# Altium project PE2.PrjPcb
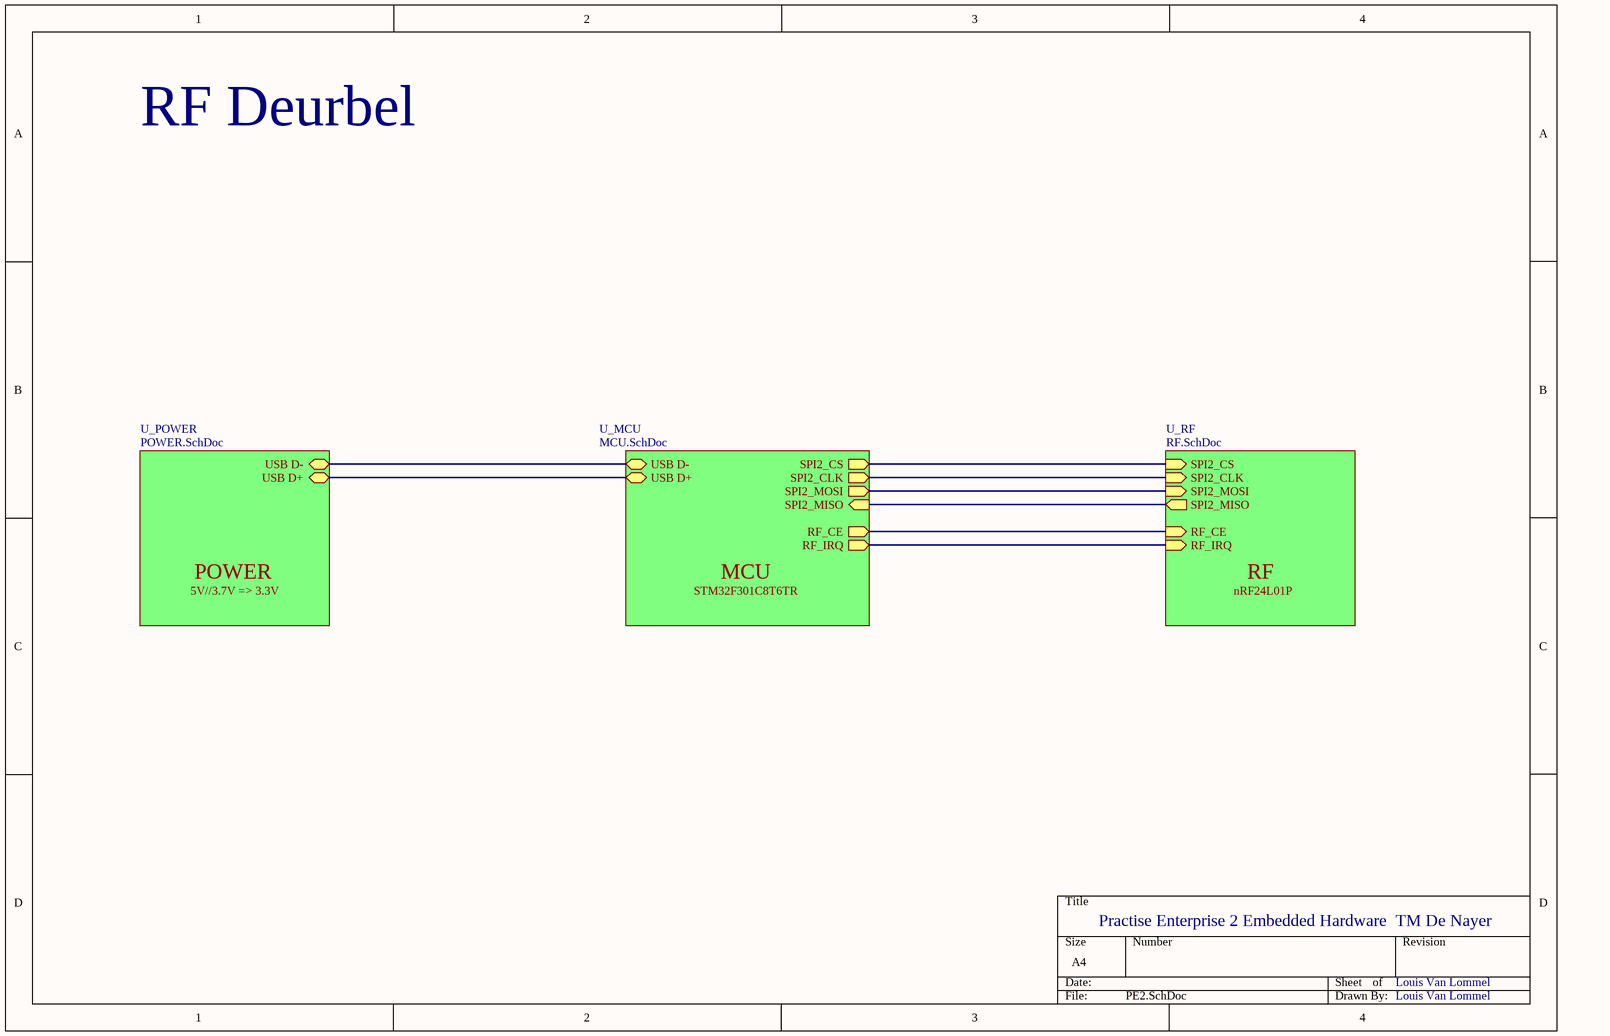
[diagram p0: PE2.SchDoc]
4 sheets, 62 parts. Net scope: hierarchical (ports join the sheet entries above them; power ports are global).
Board file: PE2.PcbDoc
Sheets:
  PE2.SchDoc
    U_POWER = POWER.SchDoc
    U_RF = RF.SchDoc
    U_MCU = MCU.SchDoc

## Sheet PE2.SchDoc
size A4

### Sub-sheets
U_MCU = MCU.SchDoc: USB D+ (bidir), USB D- (bidir), SPI2_CS (out), SPI2_CLK (out), SPI2_MISO (in), SPI2_MOSI (out), RF_CE (out), RF_IRQ (out)
U_POWER = POWER.SchDoc: USB D+ (bidir), USB D- (bidir)
U_RF = RF.SchDoc: SPI2_MOSI (in), SPI2_MISO (out), SPI2_CLK (in), SPI2_CS (in), RF_CE (in), RF_IRQ (in)

### Nets
NetD2_1: sheet U_POWER/USB D+, sheet U_MCU/USB D+
NetD2_3: sheet U_POWER/USB D-, sheet U_MCU/USB D-
NetU1_1: sheet U_RF/RF_CE, sheet U_MCU/RF_CE
NetU1_2: sheet U_RF/SPI2_CS, sheet U_MCU/SPI2_CS
NetU1_3: sheet U_RF/SPI2_CLK, sheet U_MCU/SPI2_CLK
NetU1_4: sheet U_RF/SPI2_MOSI, sheet U_MCU/SPI2_MOSI
NetU1_5: sheet U_RF/SPI2_MISO, sheet U_MCU/SPI2_MISO
NetU1_6: sheet U_RF/RF_IRQ, sheet U_MCU/RF_IRQ

### Notes on the sheet
- RF Deurbel
- POWER
- MCU
- RF
- 5V//3.7V => 3.3V
- STM32F301C8T6TR
- nRF24L01P
- Practise Enterprise 2 Embedded Hardware  TM De Nayer
- Louis Van Lommel

## Sheet POWER.SchDoc: Power
size A4; DrawnBy: Louis Van Lommel; Engineer: Louis Van Lommel; Organization: TM De Nayer
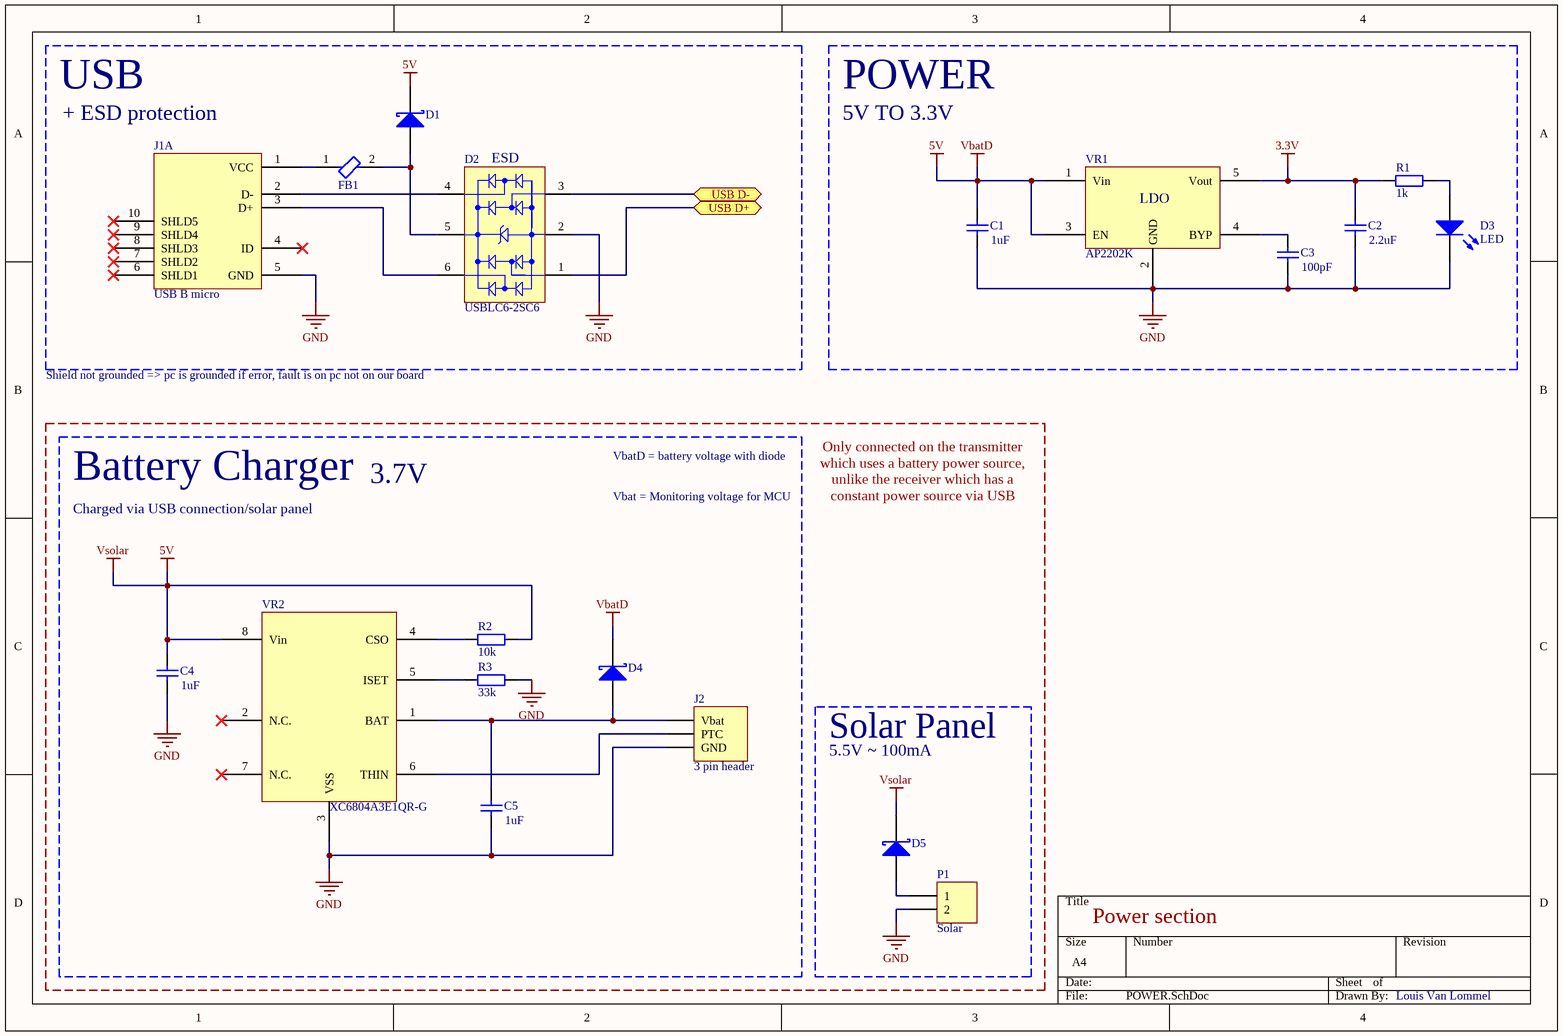
[diagram p1: POWER.SchDoc]

### Parts
C1  value 1uF  [CAP_0603]
C2  value 2.2uF  [CAP_0603]
C3  value 100pF  [CAP_0603]
C4  value 1uF  [CAP_0603]
C5  value 1uF  [CAP_0603]
D1  (no value)  [SOT-23_L]
D2  USBLC6-2SC6  [STM-SOT23-6L_V]
D3  LED  [LED_0603]
D4  (no value)  [SOT-23_L]
D5  (no value)  [SOT-23_L]
FB1  BLM18PG121SN1D  [FP-BLM18-0_15-t0_8-IPC_A]  (value not drawn)
J1  USB B micro  [USB Micro B]  (part A of 2)
J2  3 pin header  [Header_3]
P1  Solar  [HDR1X2]
R1  value 1k  [RES_0603]
R2  value 10k  [RES_0603]
R3  value 33k  [RES_0603]
VR1  AP2202K  [SOT23-5]
VR2  XC6804A3E1QR-G  [SOP127P600-8N]

### Blocks framed on the sheet
USB: D1 D2 FB1 J1
POWER: C1-C3 D3 R1 VR1
Battery Charger: C4 C5 D4 J2 R2 R3 VR2
Solar Panel: D5 P1

### Ports
USB D+ (bidir), USB D- (bidir)

### Nets
3.3V: C2.2 R1.2 VR1.5(Vout)
5V: C1.2 C4.2 D1.3(K) D4.3(K) D5.3(K) R2.1 VR1.1(Vin) VR1.3(EN) VR2.8(Vin)  [also labelled VbatD, Vsolar]
GND: C1.1 C2.1 C3.1 C4.1 C5.1 D2.2(GND) D3.2(K) J1.5(GND) J2.3(GND) P1.2 R3.1 VR1.2(GND) VR2.3(VSS)
NetC3_2: C3.2 VR1.4(BYP)
NetC5_2: C5.2 D4.1(A) J2.1(Vbat) VR2.1(BAT)
NetD1_1: D1.1(A) D2.5(VBUS) FB1.2
NetD2_1: D2.1(I/O_1) ; port USB D+
NetD2_3: D2.3(I/O_2) ; port USB D-
NetD2_4: D2.4(I/O_3) J1.2(D-)
NetD2_6: D2.6(I/O_4) J1.3(D+)
NetD3_1: D3.1(A) R1.1
NetD5_1: D5.1(A) P1.1
NetFB1_1: FB1.1 J1.1(VCC)
NetJ2_2: J2.2(PTC) VR2.6(THIN)
NetR2_2: R2.2 VR2.4(CSO)
NetR3_2: R3.2 VR2.5(ISET)

Not connected (* = marked no-connect by the designer): J1 4(ID)* 6(SHLD1)* 7(SHLD2)* 8(SHLD3)* 9(SHLD4)* 10(SHLD5)*; VR2 2(N.C.)* 7(N.C.)*

### Notes on the sheet
- (near J1) + ESD protection
- (near D2) ESD
- 5V TO 3.3V
- (near VR1) LDO
- Shield not grounded => pc is grounded if error, fault is on pc not on our board
- Charged via USB connection/solar panel
- 3.7V
- Vbat = Monitoring voltage for MCU
- VbatD = battery voltage with diode
- Only connected on the transmitter which uses a battery power source, unlike the receiver which has a constant power source via USB
- 5.5V ~ 100mA
- Power section
- Louis Van Lommel
- Title
- Size:
- Date:
- A4
- Number:
- Time:
- Revision:
- Sheet
- of
- File:

### Library data of the parts
C1-C5 = Cap: Capacitor; Published: 8-Jun-2000; LatestRevisionDate: 17-Jul-2002; LatestRevisionNote: Re-released for DXP Platform.; PackageReference: RAD-0.3; Publisher: Altium Limited; PackageDescription: Radial Cap, Thru-Hole; 2 Leads; 0.3 in Pin Spacing
D1 D4 D5 = Diode BAT17: Silicon RF Schottky Diode for Mixer Applications in the VHF/UHF Range; Note: Pin 2 is not connected and not drawn.; Published: 21-Mar-2003; LatestRevisionDate: 29-May-2009; LatestRevisionNote: IPC-7351 Footprint Added.; DatasheetVersion: Oct-1999; PackageVersion: Sep-2001; PackageReference: SOT-23; Publisher: Altium Limited; PackageDescription: 3-Pin SOT-23 Package 0.95 mm Pitch, 2.5 mm Lead Span; ComponentLink1Description: Manufacturer Link; ComponentLink1URL: http://www.infineon.com/; ComponentLink2Description: Datasheet; ComponentLink2URL: http://www.infineon.com/upload/Document/cmc_upload/documents/009/363/bat17series.pdf
D2 = CMP-2000-05378-1: Very low capacitance ESD protection, 3.5 pF, -40 to 125 degC, 6-Pin SOT23, RoHS, Tape and Reel; Manufacturer: STMicroelectronics; Polarity: Uni-Directional; Clamping Voltage: 17V; Rad Hardened: No; Product Height (mm): 1.3mm; Leakage Current (Max): 0.15uA; Product Length (mm): 3.05mm; Number of Elements: 1; Peak Pulse Current: 5A; Configuration: Dual; Reverse Breakdown Voltage: 6V; Working Voltage (Max): 5V; Capacitance Value: 3.5pF; Suppressor Type: DiodeArrays; Product Depth (mm): 1.75mm; Test Current (It): 1mA; Package / Case: SOT-23; Operating Temperature Max Deg. C: 125C; Package Description: 6-Pin Small Outline Transistor, Body 2.925 x 1.625 mm, Pitch 0.95 mm; Package Reference: SOT23-6L; Datasheet Version: Rev. 5, 10/2011; Operating Temperature Min Deg. C: -40C; Mounting Style: SurfaceMount; Direction Type: Uni-Directional; Mounting: SurfaceMount; Pin Count: 6; Leakage Current: 0.15uA; Packaging: TapeandReel; Operating Temperature Classification: Automotive; Clamping Voltage (Max): 17V; Manufacturer URL: http://www.st.com/; Reverse Stand-off Voltage: 5V; Datasheet URL: http://www.st.com/st-web-ui/static/active/en/resource/technical/document/datasheet/CD00050750.pdf; Working Voltage: 5V; Operating Temp Range: -40Cto125C
D3 = LED2: Typical RED, GREEN, YELLOW, AMBER GaAs LED; Published: 8-Jun-2000; LatestRevisionDate: 17-Jul-2002; LatestRevisionNote: Re-released for DXP Platform.; PackageVersion: Feb-2002; PackageReference: 3.2X1.6X1.1; Publisher: Altium Limited; PackageDescription: SM LED; 2 Flat Leads
FB1 = CMP-0686-00557-7: Chip Ferrite Bead, 0603, 120Ω @ 100MHz, 0.05Ω, 25%, 2A; Impedance: 120R; Number of Circuits: 1; Shielding: Unshielded; Material: Steel; DC Resistance (DCR): 50mR; Case Code (Imperial): 0603; RoHS Compliant: Yes; Number of Pins: 2; Min Operating Temperature: -55°C; Case Code (Metric): 1608; Frequency: 100MHz; Length: 1.6mm; Test Frequency: 100MHz; Max Operating Temperature: 125°C; Packaging: Tape and Reel; Max Current Rating: 2A; Termination: SMD/SMT; Lead Free: Lead Free; Max DC Current: 2A; Case/Package: 0603; Height: 0.8mm; Current Rating: 2A; Radiation Hardening: No; Core Material: Ferrite; DC Current: 2A; REACH SVHC: No SVHC; Package Quantity: 1; Depth: 0.8mm; Number of Lines: 1; Tolerance: 25%; Width: 0.8mm
J1 = USB micro B
J2 = Header_3
P1 = Header 2H: Header, 2-Pin, Right Angle; LatestRevisionDate: 17-Jul-2002; LatestRevisionNote: Re-released for DXP Platform.; Publisher: Altium Limited
R1 R2 = Res2: Resistor; Published: 8-Jun-2000; LatestRevisionDate: 17-Jul-2002; LatestRevisionNote: Re-released for DXP Platform.; PackageReference: AXIAL-0.4; Publisher: Altium Limited; PackageDescription: Axial Device, Thru-Hole; 2 Leads; 0.4 in Pin Spacing
R3 = Res2: Determines charging speed => p14. Datasheet                                 40kohm => 200mA max, solar only has 100mA; Published: 8-Jun-2000; LatestRevisionDate: 17-Jul-2002; LatestRevisionNote: Re-released for DXP Platform.; PackageReference: AXIAL-0.4; Publisher: Altium Limited; PackageDescription: Axial Device, Thru-Hole; 2 Leads; 0.4 in Pin Spacing
VR1 = AP2202K-3.3TRG1: AP2112K-3.3TRG1 | 3.3V LDO | 2.5V — 13.2V

## Sheet RF.SchDoc
size A4
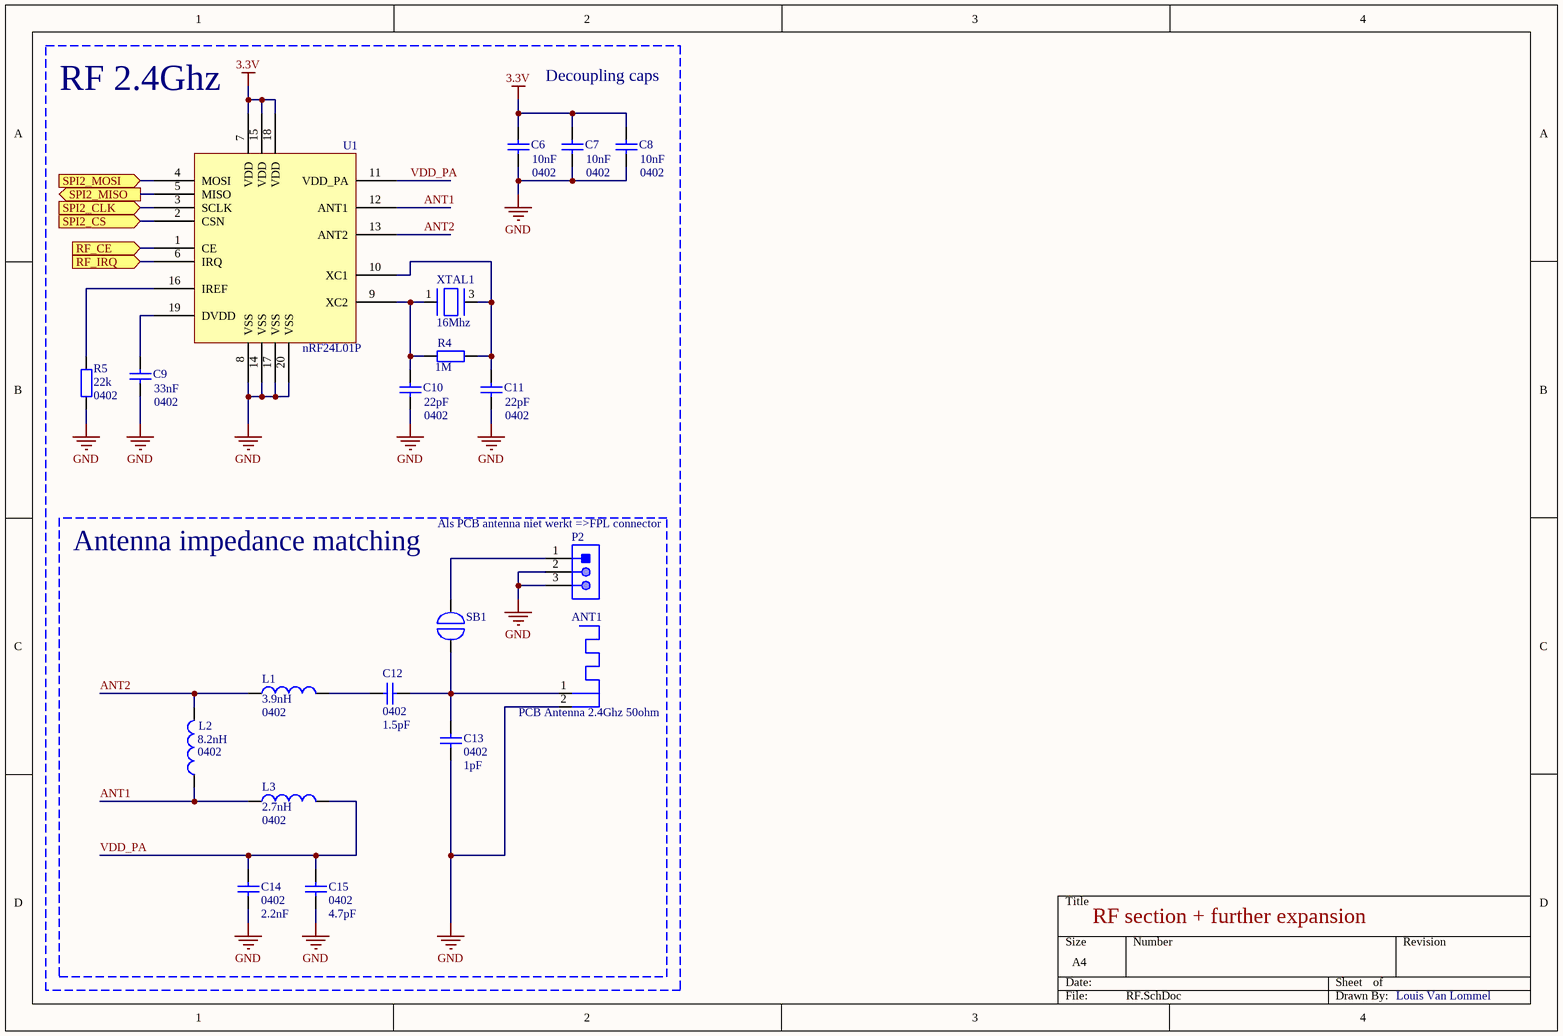
[diagram p2: RF.SchDoc]

### Parts
ANT1  PCB Antenna 2.4Ghz 50ohm  [2.4Ghz Antenna]
C6  0402  value 10nF  [CAP_0402]
C7  0402  value 10nF  [CAP_0402]
C8  0402  value 10nF  [CAP_0402]
C9  0402  value 33nF  [CAP_0402]
C10  0402  value 22pF  [CAP_0402]
C11  0402  value 22pF  [CAP_0402]
C12  0402  value 1.5pF  [CAP_0402]
C13  0402  value 1pF  [CAP_0402]
C14  0402  value 2.2nF  [CAP_0402]
C15  0402  value 4.7pF  [CAP_0402]
L1  0402  value 3.9nH  [IND_0402]
L2  0402  value 8.2nH  [IND_0402]
L3  0402  value 2.7nH  [IND_0402]
P2  (no value)  [HRS-U.FL-R-SMT-3_V]
R4  value 1M  [RES_0402]
R5  0402  value 22k  [RES_0603]
SB1  (no value)  [Solder bridge RF 0.254]
U1  nRF24L01P  [QFN20 4x4]
XTAL1  16Mhz  [16Mhz_Crystal]

### Blocks framed on the sheet
RF 2.4Ghz: C6-C11 R4 R5 U1 XTAL1
Antenna impedance matching: ANT1 C12-C15 L1-L3 P2 SB1

### Ports
RF_CE (in), RF_IRQ (in), SPI2_CLK (in), SPI2_CS (in), SPI2_MISO (out), SPI2_MOSI (in)

### Nets
3.3V: C6.2 C7.2 C8.2 U1.7(VDD) U1.15(VDD) U1.18(VDD)
GND: ANT1.2(GND) C6.1 C7.1 C8.1 C9.1 C10.1 C11.1 C13.2 C14.2 C15.2 P2.2 P2.3 R5.2 U1.8(VSS) U1.14(VSS) U1.17(VSS) U1.20(VSS)
ANT1: L2.1 L3.1 U1.12(ANT1)
ANT2: L1.1 L2.2 U1.13(ANT2)
VDD_PA: C14.1 C15.1 L3.2 U1.11(VDD_PA)
NetANT1_1: ANT1.1(RF) C12.1 C13.1 SB1.3
NetC9_2: C9.2 U1.19(DVDD)
NetC10_2: C10.2 R4.1 U1.9(XC2) XTAL1.1
NetC11_2: C11.2 R4.2 U1.10(XC1) XTAL1.3
NetC12_2: C12.2 L1.2
NetP2_1: P2.1 SB1.4
NetR5_1: R5.1 U1.16(IREF)
NetU1_1: U1.1(CE) ; port RF_CE
NetU1_2: U1.2(CSN) ; port SPI2_CS
NetU1_3: U1.3(SCLK) ; port SPI2_CLK
NetU1_4: U1.4(MOSI) ; port SPI2_MOSI
NetU1_5: U1.5(MISO) ; port SPI2_MISO
NetU1_6: U1.6(IRQ) ; port RF_IRQ

### Notes on the sheet
- Decoupling caps
- (near P2) Als PCB antenna niet werkt =>FPL connector
- RF section + further expansion
- Louis Van Lommel

### Library data of the parts
ANT1 = Antenna 2.4Ghz
C6-C15 = Cap: Capacitor; Published: 8-Jun-2000; LatestRevisionDate: 17-Jul-2002; LatestRevisionNote: Re-released for DXP Platform.; PackageReference: RAD-0.3; Publisher: Altium Limited; PackageDescription: Radial Cap, Thru-Hole; 2 Leads; 0.3 in Pin Spacing
L1-L3 = Inductor: Code_IEC: 1005; Published: 8-Jun-2000; LatestRevisionDate: 29-May-2009; LatestRevisionNote: IPC-7351 Footprint Added.; PackageReference: 0402-A; Publisher: Altium Limited; PackageDescription: Chip Inductor; Code_JEITA: 0402
P2 = CMP-2000-05153-1: Ultra Small Coaxial Connector, 6 GHz, -40 to 90 degC, 3-Pin SMD, RoHS, Bulk; Manufacturer: Hirose Electric; Connector Style: U.FL; Impedance: 50Ohm; Dielectric Material: LiquidCrystalPolymer(LCP); Minimum Quantity: UltraMiniatureCoaxial; Online Catalog: U.FLSeries; Featured Product: HiroseU.FLSeries; Frequency - Max: 6GHz; Other Names: H122041 / U.FL-R-SMT-1(01)-ND; Contact Termination: Solder; Body Material: PhosphorBronze; Connector Type: Jack,MalePin; Body Finish: Silver; Center Contact Plating: Gold; Manufacturer URL: https://www.hirose.com; Family: CoaxialConnectors(RF); Fastening Type: Snap-On; Unit PriceUSD: U.FL; Series: U.FL; Package Reference: U.FL-R-SMT; Packaging: Bulk; Standard Package: 100; Mounting Type: SurfaceMount; Quantity Available: Bulk; Housing Color: Silver; Package Description: 3-Pin Surface Mount Device, Body 2.6 x 2.6 mm; Category: Connectors,Interconnects; Operating Temperature: -40degC~90degC; Center Contact Material: PhosphorBronze; Dynamic Catalog: U.FLSeries; Datasheet URL: https://datasheet.ciiva.com/26945/getdatasheetpartid-475239-26945414.pdf; Datasheet Version: Feb-09; Shield Termination: Solder
R4 R5 = Res2: Resistor; Published: 8-Jun-2000; LatestRevisionDate: 17-Jul-2002; LatestRevisionNote: Re-released for DXP Platform.; PackageReference: AXIAL-0.4; Publisher: Altium Limited; PackageDescription: Axial Device, Thru-Hole; 2 Leads; 0.4 in Pin Spacing
SB1 = Solder bridge
U1 = nRF24L01P: Single Chip Transceiver, 2.4 GHz, 60 mW, 1.9 to 3.6 V, -40 to 85 degC, 20-Pin QFN, RoHS, Tray
XTAL1 = Crystal: Crystal, 16 MHz, SMD, 3.2mm x 2.5mm, 30 ppm, 18 pF, 30 ppm, 7M

## Sheet MCU.SchDoc
size A4
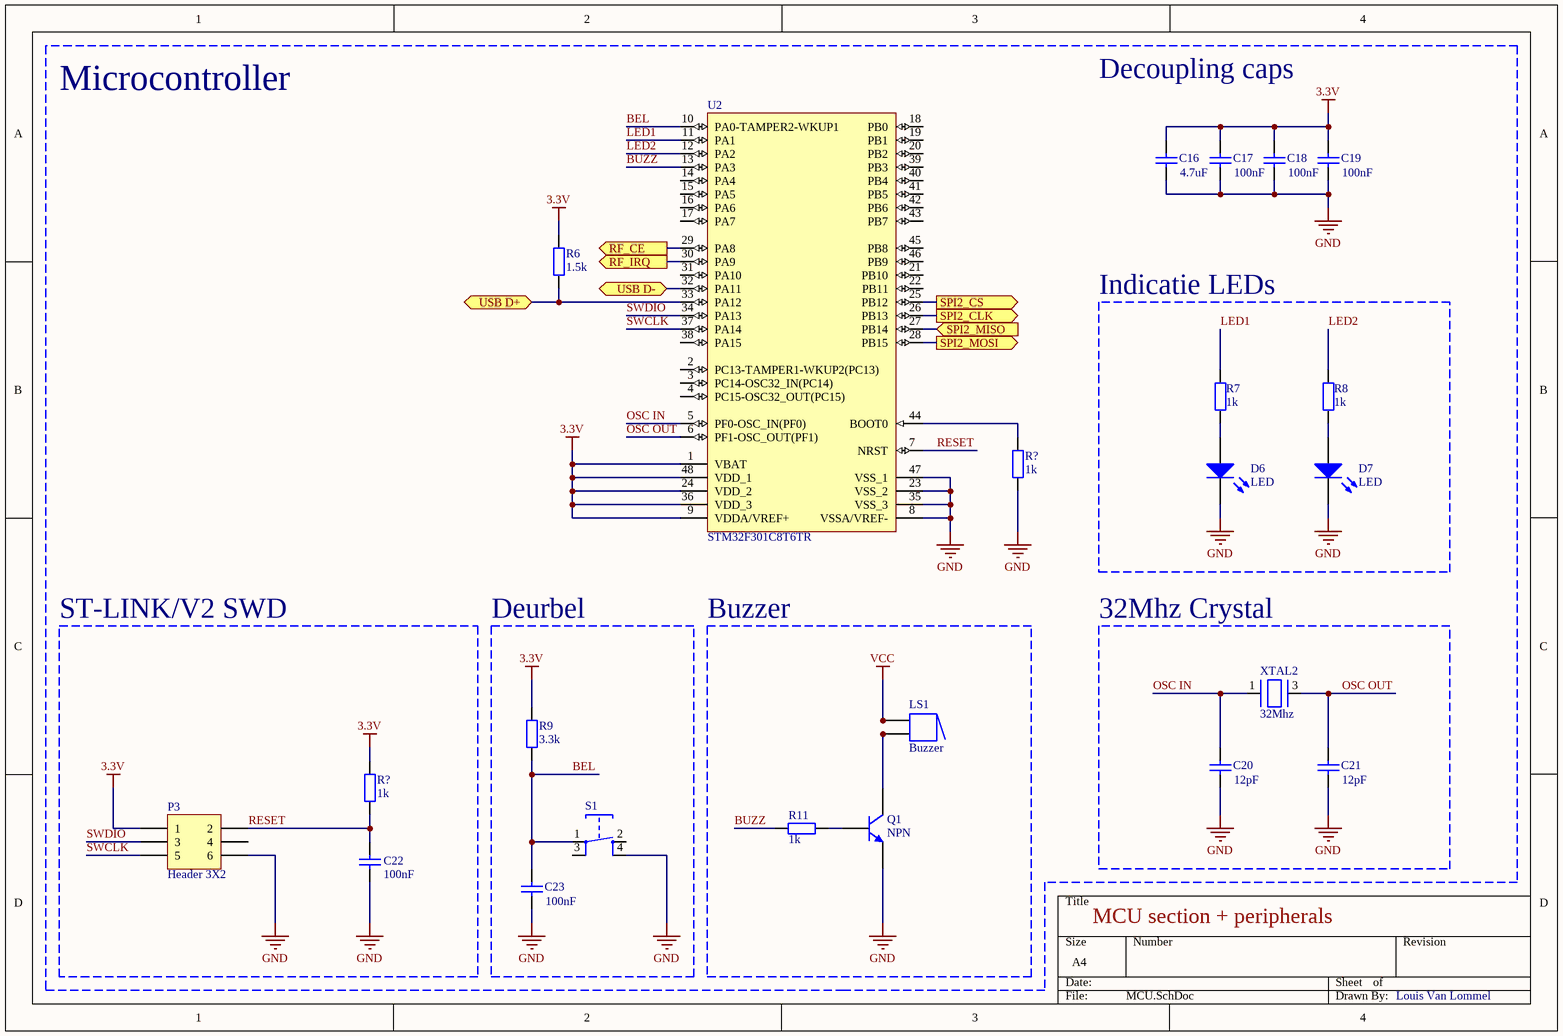
[diagram p3: MCU.SchDoc]

### Parts
(Parts that share a designator on the sheet are numbered #1, #2 ... from top to bottom, then left to right.)
C16  value 4.7uF  [CAP_0603]
C17  value 100nF  [CAP_0603]
C18  value 100nF  [CAP_0603]
C19  value 100nF  [CAP_0603]
C20  value 12pF  [CAP_0603]
C21  value 12pF  [CAP_0603]
C22  value 100nF  [CAP_0603]
C23  value 100nF  [CAP_0603]
D6  LED  [LED_0603]
D7  LED  [LED_0603]
LS1  Buzzer  [Buzzer]
P3  Header 3X2  [HDR2X3]
Q1  NPN  [SOT23_L]
R6  value 1.5k  [RES_0603]
R7  value 1k  [RES_0603]
R8  value 1k  [RES_0603]
R9  value 3.3k  [RES_0603]
R11  value 1k  [RES_0603]
R?#1  value 1k  [RES_0603]
R?#2  value 1k  [RES_0603]
S1  (no value)  [TactileSwitch6x6]
U2  STM32F301C8T6TR  [STM-LQFP48_M]
XTAL2  32Mhz  [16Mhz_Crystal]

### Blocks framed on the sheet
Indicatie LEDs: D6 D7 R7 R8
ST-LINK/V2 SWD: C22 P3 R?#2
Deurbel: C23 R9 S1
Buzzer: LS1 Q1 R11
32Mhz Crystal: C20 C21 XTAL2

### Ports
RF_CE (out), RF_IRQ (out), SPI2_CLK (out), SPI2_CS (out), SPI2_MISO (in), SPI2_MOSI (out), USB D+ (bidir), USB D- (bidir)

### Nets
3.3V: C16.2 C17.2 C18.2 C19.2 P3.1 R6.1 R9.1 R?#2.1 U2.1(VBAT) U2.9(VDDA/VREF+) U2.24(VDD_2) U2.36(VDD_3) U2.48(VDD_1)
GND: C16.1 C17.1 C18.1 C19.1 C20.1 C21.1 C22.1 C23.1 D6.2(K) D7.2(K) P3.6 Q1.3(E) R?#1.2 S1.4 U2.8(VSSA/VREF-) U2.23(VSS_2) U2.35(VSS_3) U2.47(VSS_1)
VCC: LS1.1 LS1.1A
BEL: C23.2 R9.2 S1.1 U2.10(PA0-TAMPER2-WKUP1)
BUZZ: R11.1 U2.13(PA3)
LED1: R7.2 U2.11(PA1)
LED2: R8.2 U2.12(PA2)
OSC IN: C20.2 U2.5(PF0-OSC_IN(PF0)) XTAL2.1
OSC OUT: C21.2 U2.6(PF1-OSC_OUT(PF1)) XTAL2.3
RESET: C22.2 P3.2 R?#2.2 U2.7(NRST)
SWCLK: P3.5 U2.37(PA14)
SWDIO: P3.3 U2.34(PA13)
NetD2_1: R6.2 U2.33(PA12) ; port USB D+
NetD2_3: U2.32(PA11) ; port USB D-
NetD6_1: D6.1(A) R7.1
NetD7_1: D7.1(A) R8.1
NetLS1_2: LS1.2 LS1.2A Q1.1(C)
NetQ1_2: Q1.2(B) R11.2
NetR?#1_1: R?#1.1 U2.44(BOOT0)
NetU1_1: U2.29(PA8) ; port RF_CE
NetU1_2: U2.25(PB12) ; port SPI2_CS
NetU1_3: U2.26(PB13) ; port SPI2_CLK
NetU1_4: U2.28(PB15) ; port SPI2_MOSI
NetU1_5: U2.27(PB14) ; port SPI2_MISO
NetU1_6: U2.30(PA9) ; port RF_IRQ

Not connected (* = marked no-connect by the designer): P3 4; S1 2 3; U2 2(PC13-TAMPER1-WKUP2(PC13)) 3(PC14-OSC32_IN(PC14)) 4(PC15-OSC32_OUT(PC15)) 14(PA4) 15(PA5) 16(PA6) 17(PA7) 18(PB0) 19(PB1) 20(PB2) 21(PB10) 22(PB11) 31(PA10) 38(PA15) 39(PB3) 40(PB4) 41(PB5) 42(PB6) 43(PB7) 45(PB8) 46(PB9)

### Notes on the sheet
- Microcontroller
- Decoupling caps
- MCU section + peripherals
- Louis Van Lommel

### Library data of the parts
C16-C23 = Cap: Capacitor; Published: 8-Jun-2000; LatestRevisionDate: 17-Jul-2002; LatestRevisionNote: Re-released for DXP Platform.; PackageReference: RAD-0.3; Publisher: Altium Limited; PackageDescription: Radial Cap, Thru-Hole; 2 Leads; 0.3 in Pin Spacing
D6 D7 = LED2: as D3 on sheet POWER; Published: 8-Jun-2000; LatestRevisionDate: 17-Jul-2002; LatestRevisionNote: Re-released for DXP Platform.; PackageVersion: Feb-2002; PackageReference: 3.2X1.6X1.1; Publisher: Altium Limited; PackageDescription: SM LED; 2 Flat Leads
LS1 = Buzzer: Magnetic Transducer Buzzer; Published: 24-Mar-1999; LatestRevisionDate: 17-Dec-2003; LatestRevisionNote: Schematic revised, PCB Footprint replaced.; DatasheetVersion: 17-Dec-2003; PackageReference: ABSM-1574; Publisher: Altium Limited; PackageDescription: Magnetic Transducer Buzzer; ComponentLink1Description: Manufacturer Link; ComponentLink1URL: http://www.megastar.com/linecard/buzzmode/index.php
P3 = Header 3X2: Header, 3-Pin, Dual row; LatestRevisionDate: 17-Jul-2002; LatestRevisionNote: Re-released for DXP Platform.; Publisher: Altium Limited
Q1 = NPN: NPN Bipolar Transistor; Published: 8-Jun-2000; LatestRevisionDate: 17-Jul-2002; LatestRevisionNote: Re-released for DXP Platform.; PackageReference: TO-226-AA; Publisher: Altium Limited; PackageDescription: TO, Flat Index; 3 In-Line, Axial Leads; Body Dia. 4.8mm; Leads 0.55 x 0.51 mm (max); Code_JEDEC: TO-226-AA
R6-R9 R11 R?#1 R?#2 = Res2: Resistor; Published: 8-Jun-2000; LatestRevisionDate: 17-Jul-2002; LatestRevisionNote: Re-released for DXP Platform.; PackageReference: AXIAL-0.4; Publisher: Altium Limited; PackageDescription: Axial Device, Thru-Hole; 2 Leads; 0.4 in Pin Spacing
S1 = Tactile Switch: gekruisde schakelaar (1.4 en 2.3)
U2 = CMP-0537-00001-2: ARM Cortex-M4 32-bit MCU, 64 KB Flash, 16 KB Internal RAM, 37 I/Os, 48-Pin LQFP, -40 to 85 degC, Tape and Reel; FLASH Size (Prog) (kB): 64; Internal RAM Size (kB): 16; D/A Converter: 1; Operating Frequency(F) (Processor speed) (MHz): 72; Supply Voltage(Vcc) min (V): 2; I/Os (High Current): 37; ComponentLink2Description: Datasheet; ComponentLink1URL: http://www.st.com/; Package Description: 48-Pin Low Profile Quad Flat Package, Body 7 x 7 mm, Pitch 0.5 mm; ComponentLink1Description: Manufacturer URL; ComponentLink2URL: http://www.st.com/st-web-ui/static/active/en/resource/technical/document/datasheet/DM00093332.pdf; Mounting Technology: Surface Mount; Packing: Tape and Reel; DatasheetVersion: Rev. 6; Package Reference: LQFP48; Core: ARM Cortex-M4
XTAL2 = Crystal: as XTAL1 on sheet RF

## Nets that join several sheets
3.3V: POWER (C2.2 R1.2 VR1.5), RF (6 pins), MCU (13 pins)
GND: POWER (13 pins), RF (17 pins), MCU (18 pins)
NetD2_1: POWER (D2.1), MCU (R6.2 U2.33)
NetD2_3: POWER (D2.3), MCU (U2.32)
NetU1_1: RF (U1.1), MCU (U2.29)
NetU1_2: RF (U1.2), MCU (U2.25)
NetU1_3: RF (U1.3), MCU (U2.26)
NetU1_4: RF (U1.4), MCU (U2.28)
NetU1_5: RF (U1.5), MCU (U2.27)
NetU1_6: RF (U1.6), MCU (U2.30)